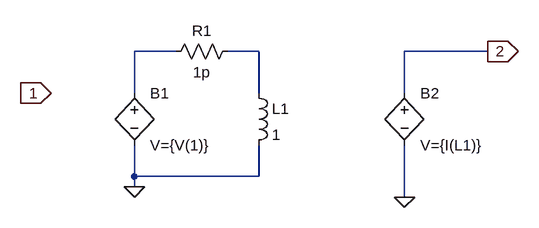
[diagram p0: schematic integral.asc]
integral.asc, the LTspice schematic file:
Version 4
SHEET 1 880 680
WIRE 128 64 64 64
WIRE 256 64 208 64
WIRE 608 64 480 64
WIRE 64 128 64 64
WIRE 256 128 256 64
WIRE 480 128 480 64
WIRE 64 256 64 208
WIRE 256 256 256 208
WIRE 256 256 64 256
WIRE 64 272 64 256
WIRE 480 288 480 208
FLAG -64 128 1
IOPIN -64 128 In
FLAG 64 272 0
FLAG 480 288 0
FLAG 608 64 2
IOPIN 608 64 Out
SYMBOL bv 64 112 R0
SYMATTR InstName B1
SYMATTR Value V={V(1)}
SYMBOL bv 480 112 R0
SYMATTR InstName B2
SYMATTR Value V={I(L1)}
SYMBOL ind 240 112 R0
SYMATTR InstName L1
SYMATTR Value 1
SYMBOL res 224 48 R90
WINDOW 0 0 56 VBottom 2
WINDOW 3 32 56 VTop 2
SYMATTR InstName R1
SYMATTR Value 1p

The netlist it stands for:
* integral.asc
B1 N001 0 V={V(1)}
B2 2 0 V={I(L1)}
L1 N002 0 1
R1 N002 N001 1p
.backanno
.end